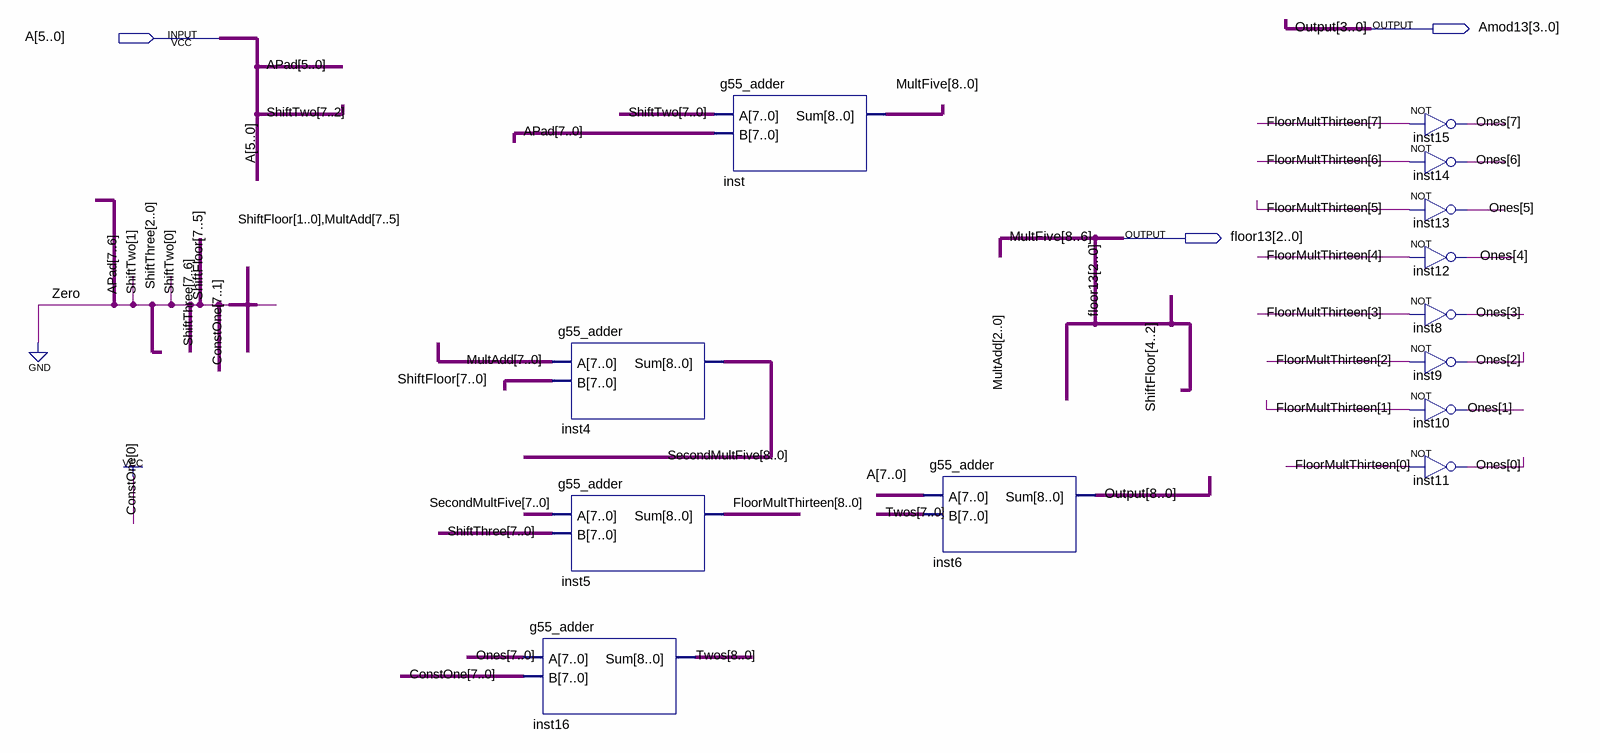
[diagram p0: schematic sheet]
// Quartus schematic g55_mod13.bdf as structural Verilog: 13 symbols, 3 pins
module g55_mod13 (
  input  [7:0] A,
  output [3:0] Amod13,
  output [2:0] floor13
);

  wire [5:0] MultFive;
  wire [7:0] APad, MultAdd, Ones, ShiftFloor, ShiftThree, ShiftTwo;
  wire [7:1] ConstOne;
  wire [8:0] FloorMultThirteen, SecondMultFive, Twos;
  wire [8:4] Output;

  g55_adder inst4 (.A(MultAdd), .B(ShiftFloor), .Sum(SecondMultFive));
  g55_adder inst5 (.A(SecondMultFive[7:0]), .B(ShiftThree), .Sum(FloorMultThirteen));
  g55_adder inst16 (.A(Ones), .B({ConstOne, 1'b1}), .Sum(Twos));
  g55_adder inst (.A(ShiftTwo), .B(APad), .Sum({floor13, MultFive}));
  g55_adder inst6 (.A(A), .B(Twos[7:0]), .Sum({Output, Amod13}));
  not inst15 (Ones[7], FloorMultThirteen[7]);
  not inst14 (Ones[6], FloorMultThirteen[6]);
  not inst13 (Ones[5], FloorMultThirteen[5]);
  not inst12 (Ones[4], FloorMultThirteen[4]);
  not inst8 (Ones[3], FloorMultThirteen[3]);
  not inst9 (Ones[2], FloorMultThirteen[2]);
  not inst10 (Ones[1], FloorMultThirteen[1]);
  not inst11 (Ones[0], FloorMultThirteen[0]);

  // Other names for the same wires on the sheet: MultFive[8:6] = floor13; Output[3:0] = Amod13
endmodule
